# Altium project PCB_Project.PrjPcb
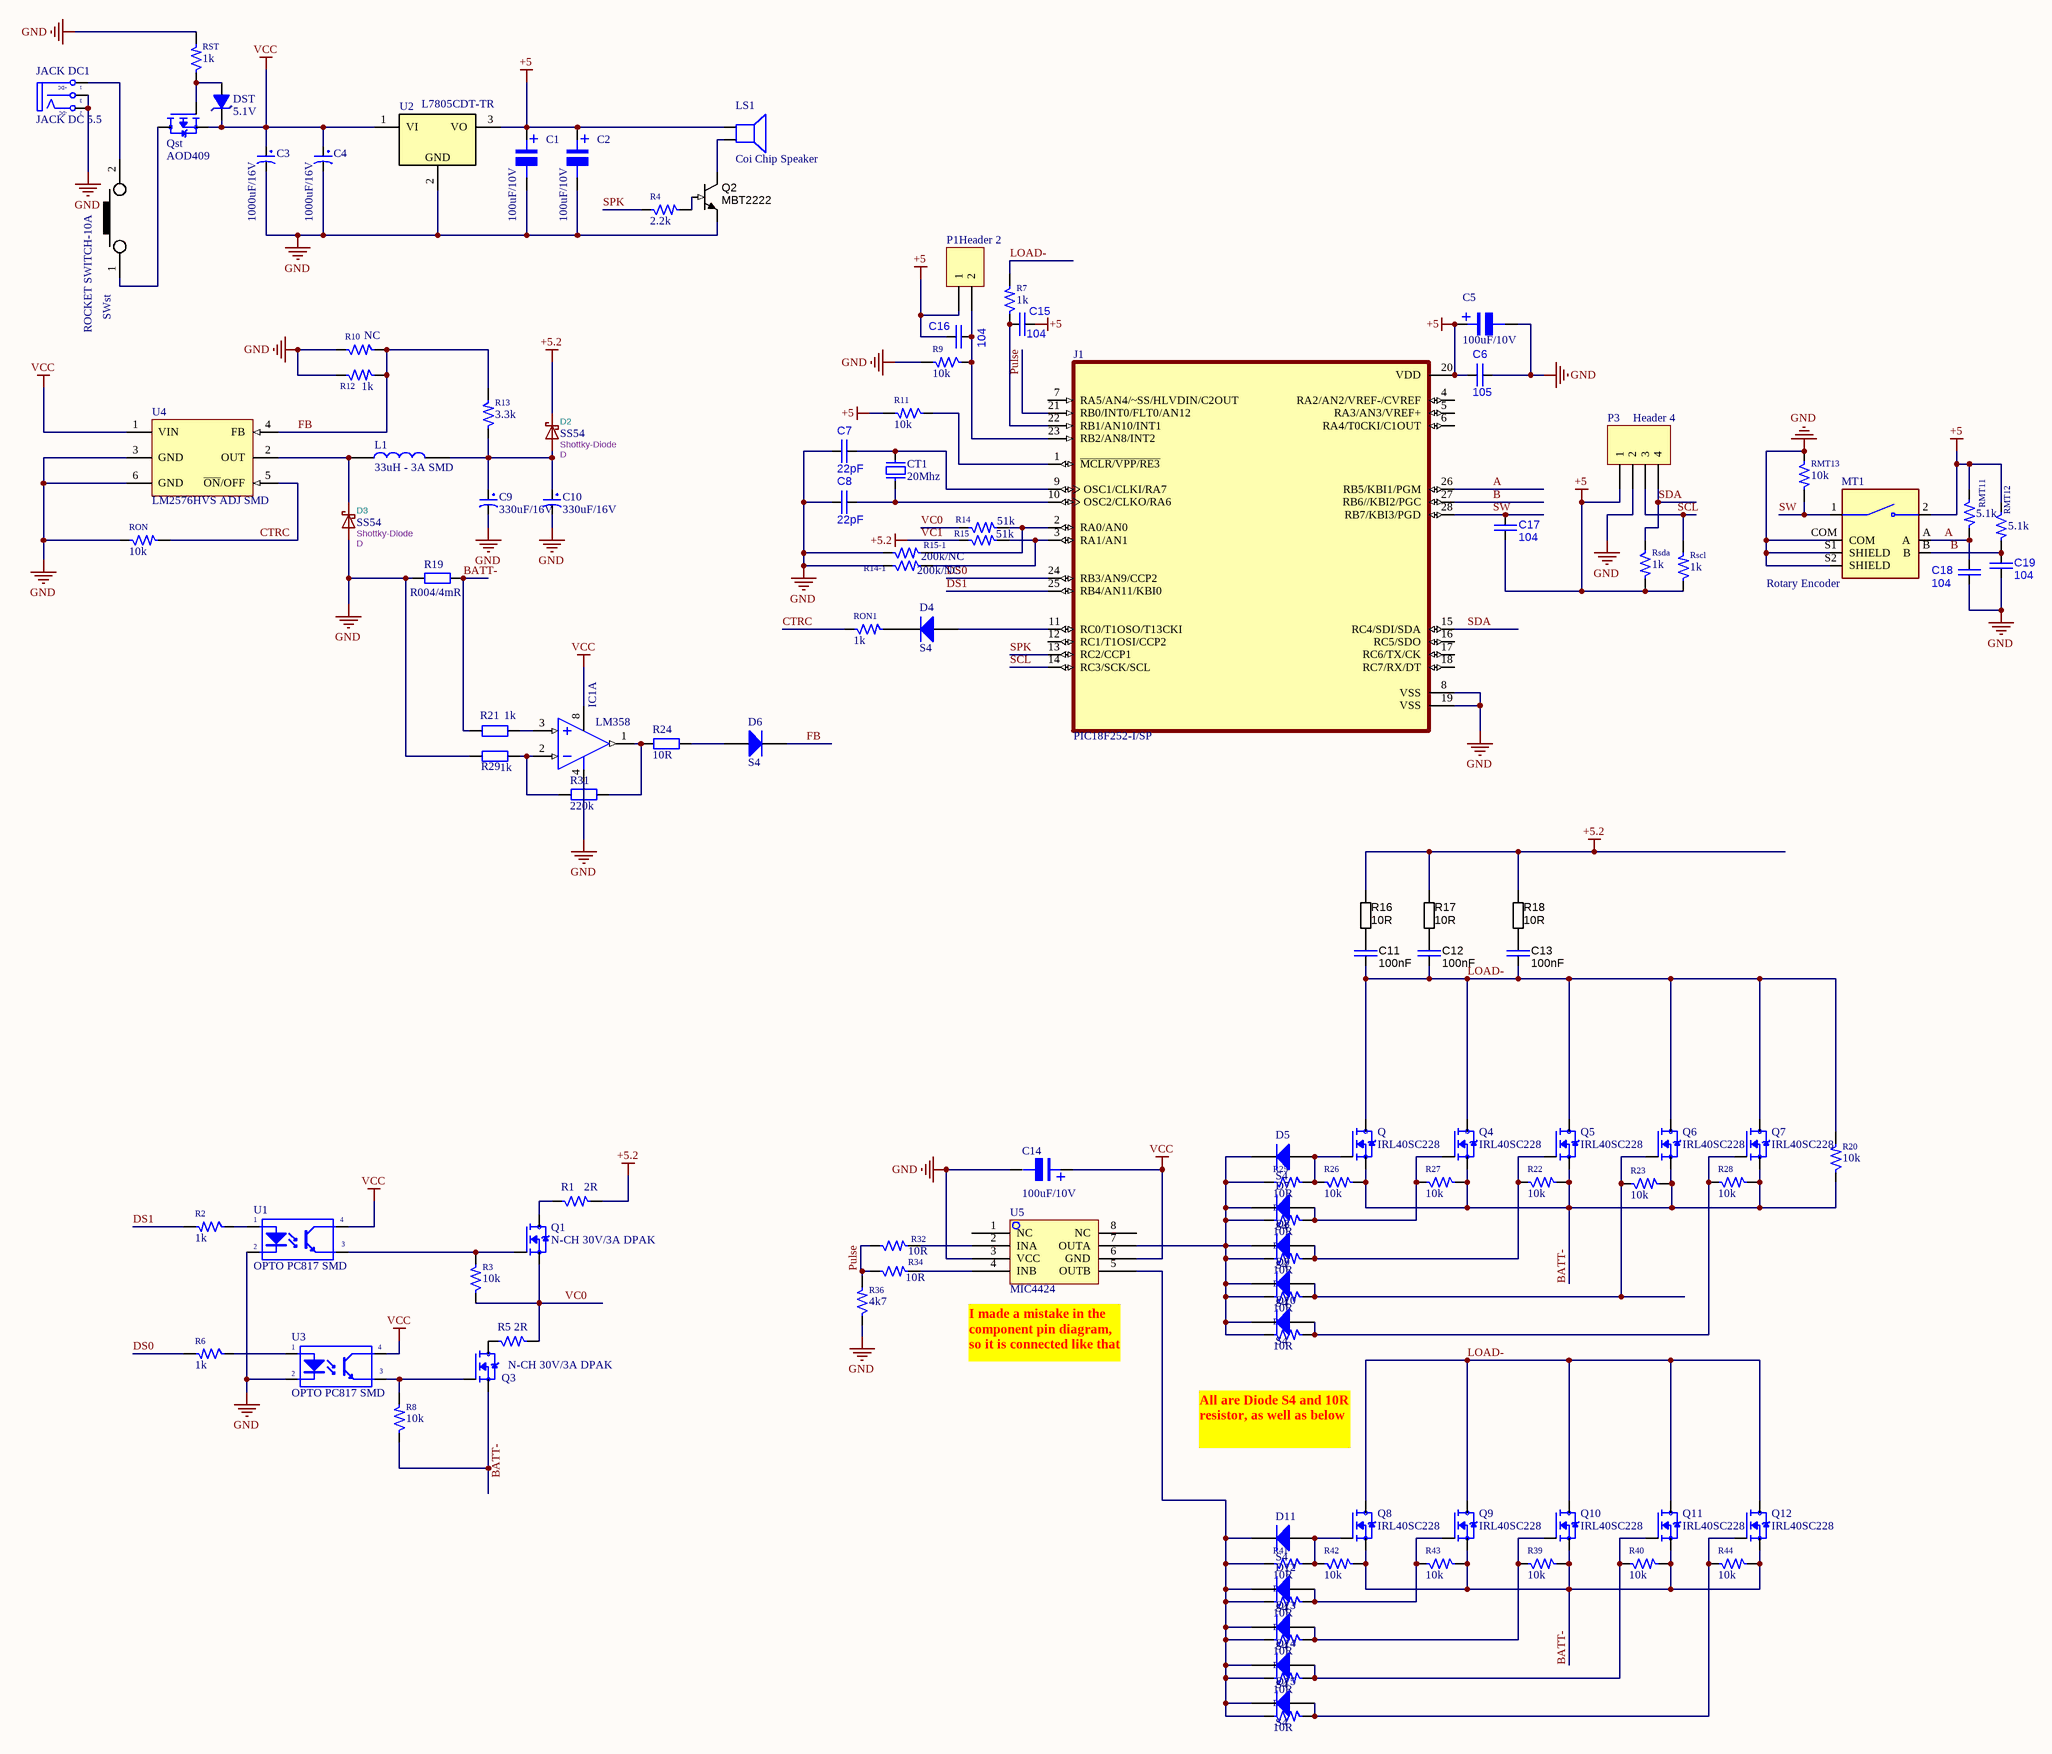
[diagram p0: Spot Welder OLED.SchDoc]
1 sheet, 120 parts. Net scope: global (net labels, ports and power ports of the same name join across sheets).
Board file: Spot Welder Layout.PcbDoc

## Sheet Spot Welder OLED.SchDoc
size C; SheetNumber: 1; SheetTotal: 1

### Parts
C1  100uF/10V  [tu nhom 6.3 (d)]
C2  100uF/10V  [tu nhom 6.3 (d)]
C3  1000uF/16V  [tu hoa 10mm]
C4  1000uF/16V  [tu hoa 10mm]
C5  100uF/10V  [tu nhom 6.3 (d)]
C6  value 105  [CAPC2012X135N]  (hidden comment: 0805)
C7  value 22pF  [CAPC2012X135N]  (hidden comment: 0805)
C8  value 22pF  [CAPC2012X135N]  (hidden comment: 0805)
C9  330uF/16V  [tu hoa 10mm]
C10  330uF/16V  [tu hoa 10mm]
C11  value 100nF  [CAPC3216X180N]  (hidden comment: 1206)
C12  value 100nF  [CAPC3216X180N]  (hidden comment: 1206)
C13  value 100nF  [CAPC3216X180N]  (hidden comment: 1206)
C14  100uF/10V  [tu nhom 6.3 (d)]
C15  value 104  [CAPC2012X135N]  (hidden comment: 0805)
C16  value 104  [CAPC2012X135N]  (hidden comment: 0805)
C17  value 104  [CAPC2012X135N]  (hidden comment: 0805)
C18  value 104  [CAPC2012X135N]  (hidden comment: 0805)
C19  value 104  [CAPC2012X135N]  (hidden comment: 0805)
CT1  20Mhz  [CRYSTAL]
D2  SS54  value Shottky-Diode  Reference: D  [DO-214AB_SMC]
D3  SS54  value Shottky-Diode  Reference: D  [DO-214AB_SMC]
D4  S4  [DIODE SOD-123]
D5  S4  [DIODE SOD-123]
D6  S4  [DIODE SOD-123]
D7  S4  [DIODE SOD-123]
D8  S4  [DIODE SOD-123]
D9  S4  [DIODE SOD-123]
D10  S4  [DIODE SOD-123]
D11  S4  [DIODE SOD-123]
D12  S4  [DIODE SOD-123]
D13  S4  [DIODE SOD-123]
D14  S4  [DIODE SOD-123]
D15  S4  [DIODE SOD-123]
DST  5.1V  [DIODE ZENNER SMD SOD80]
IC1  LM358  [SOp 8]  (part A of 2)
J1  PIC18F252-I/SP  [DIP787W46P254L3467H508Q28]
JACK_DC1  JACK DC 5.5  [JACK DC 5.5]
L1  33uH - 3A SMD  [Cuon Cam 12x12x10]
LS1  Coi Chip Speaker  [Coi Chip Speacker]
MT1  Rotary Encoder  [XDCR_PEC11R-4215F-S0024]
P1  Header 2  [HDR1X2]
P3  Header 4  [HDR1X4]
Q  IRL40SC228  [DPAK127P1524X483-8N]
Q1  N-CH 30V/3A DPAK  [TO229P990X239-4N]
Q2  MBT2222  [SOT23-3]
Q3  N-CH 30V/3A DPAK  [TO229P990X239-4N]
Q4  IRL40SC228  [DPAK127P1524X483-8N]
Q5  IRL40SC228  [DPAK127P1524X483-8N]
Q6  IRL40SC228  [DPAK127P1524X483-8N]
Q7  IRL40SC228  [DPAK127P1524X483-8N]
Q8  IRL40SC228  [DPAK127P1524X483-8N]
Q9  IRL40SC228  [DPAK127P1524X483-8N]
Q10  IRL40SC228  [DPAK127P1524X483-8N]
Q11  IRL40SC228  [DPAK127P1524X483-8N]
Q12  IRL40SC228  [DPAK127P1524X483-8N]
Qst  AOD409  [TO252]
R1  2R  [R2W]
R2  1k  [SM-RES-0805]
R3  10k  [SM-RES-0805]
R4  2.2k  [SM-RES-0805]
R5  2R  [R2W]
R6  1k  [SM-RES-0805]
R7  1k  [SM-RES-0805]
R8  10k  [SM-RES-0805]
R9  10k  [SM-RES-0805]
R10  NC  [SM-RES-0805]
R11  10k  [SM-RES-0805]
R12  1k  [SM-RES-0805]
R13  3.3k  [SM-RES-0805]
R14  51k  [SM-RES-0805]
R14-1  200k/NC  [SM-RES-0805]
R15  51k  [SM-RES-0805]
R15-1  200k/NC  [SM-RES-0805]
R16  value 10R  [RESC3216N_ZERO]  (hidden comment: Thick Film)
R17  value 10R  [RESC3216N_ZERO]  (hidden comment: Thick Film)
R18  value 10R  [RESC3216N_ZERO]  (hidden comment: Thick Film)
R19  R004/4mR  [tro smd 2512]
R20  10k  [SM-RES-0805]
R21  1k  [tro smd 0805]
R22  10k  [SM-RES-0805]
R23  10k  [SM-RES-0805]
R24  10R  [tro smd 0805]
R25  10R  [SM-RES-0805]
R26  10k  [SM-RES-0805]
R27  10k  [SM-RES-0805]
R28  10k  [SM-RES-0805]
R29  1k  [tro smd 0805]
R30  10R  [SM-RES-0805]
R31  220k  [tro smd 0805]
R32  10R  [SM-RES-0805]
R33  10R  [SM-RES-0805]
R34  10R  [SM-RES-0805]
R35  10R  [SM-RES-0805]
R36  4k7  [SM-RES-0805]
R38  10R  [SM-RES-0805]
R39  10k  [SM-RES-0805]
R40  10k  [SM-RES-0805]
R41  10R  [SM-RES-0805]
R42  10k  [SM-RES-0805]
R43  10k  [SM-RES-0805]
R44  10k  [SM-RES-0805]
R45  10R  [SM-RES-0805]
R46  10R  [SM-RES-0805]
R47  10R  [SM-RES-0805]
R48  10R  [SM-RES-0805]
RMT11  5.1k  [SM-RES-0805]
RMT12  5.1k  [SM-RES-0805]
RMT13  10k  [SM-RES-0805]
RON  10k  [SM-RES-0805]
RON1  1k  [SM-RES-0805]
Rscl  1k  [SM-RES-0805]
Rsda  1k  [SM-RES-0805]
RST  1k  [SM-RES-0805]
SWst  ROCKET SWITCH-10A  [SW_2ARS_TH]
U1  OPTO PC817 SMD  [SOP4]
U2  L7805CDT-TR  [DPAK_118_446_112X59_SMD]
U3  OPTO PC817 SMD  [SOP4]
U4  LM2576HVS ADJ SMD  [TO263-5]
U5  MIC4424  [SOp 8]

### Nets
+5: C1.1 C2.1 C5.1 C6.1 C15.2 C16.2 C17.1 J1.20(VDD) LS1.1 MT1.2 P1.1 P3.1 R11.2 RMT11.1 RMT12.1 Rscl.1 Rsda.2 U2.3(VO)
GND: C1.2 C2.2 C3.2 C4.2 C5.2 C6.2 C7.1 C8.1 C9.2 C10.2 C14.2 C18.1 C19.1 D3.A IC1.4(-V) J1.8(VSS) J1.19(VSS) JACK_DC1.2(TN) JACK_DC1.3(S) MT1.COM MT1.S1(SHIELD) MT1.S2(SHIELD) P3.2 Q2.2(E) R9.2 R10.1 R12.1 R14-1.1 R15-1.1 R19.1 R29.1 R36.1 RMT13.1 RON.1 RST.2 U1.2(K) U2.2 U3.2(K) U4.3(GND) U4.6(GND) U5.3(VCC)
VC1: D2.K R1.2 R15.1 R16.1 R17.1 R18.1  [also labelled +5.2]
VCC: C3.1 C4.1 C14.1 DST.2(K) IC1.8(+V) Qst.2(S) U1.4(C) U2.1(VI) U3.4(C) U4.1(VIN) U5.6(GND)
A: C18.2 J1.26(RB5/KBI1/PGM) MT1.A RMT11.2
B: C19.2 J1.27(RB6//KBI2/PGC) MT1.B RMT12.2
BATT-: Q.2-8(S) Q3.3(S) Q4.2-8(S) Q5.2-8(S) Q6.2-8(S) Q7.2-8(S) Q8.2-8(S) Q9.2-8(S) Q10.2-8(S) Q11.2-8(S) Q12.2-8(S) R8.1 R19.2 R20.1 R21.1 R22.2 R23.2 R26.2 R27.2 R28.2 R39.2 R40.2 R42.2 R43.2 R44.2
CTRC: RON.2 RON1.1 U4.5(~{ON}/OFF)
DS0: J1.24(RB3/AN9/CCP2) R6.2
DS1: J1.25(RB4/AN11/KBI0) R2.2
FB: D6.2(K) R10.2 R12.2 R13.2 U4.4(FB)
LOAD-: C11.1 C12.1 C13.1 Q.9(D) Q4.9(D) Q5.9(D) Q6.9(D) Q7.9(D) Q8.9(D) Q9.9(D) Q10.9(D) Q11.9(D) Q12.9(D) R7.2 R20.2
Pulse: J1.21(RB0/INT0/FLT0/AN12) R32.1 R34.1 R36.2
SCL: J1.14(RC3/SCK/SCL) P3.3 Rscl.2
SDA: J1.15(RC4/SDI/SDA) P3.4 Rsda.1
SPK: J1.13(RC2/CCP1) R4.1
SW: C17.2 J1.28(RB7/KBI3/PGD) MT1.1 RMT13.2
VC0: Q1.3(S) R3.1 R5.2 R14.1
NetC7_2: C7.2 CT1.2 J1.9(OSC1/CLKI/RA7)
NetC8_2: C8.2 CT1.1 J1.10(OSC2/CLKO/RA6)
NetC9_1: C9.1 C10.1 D2.A L1.2 R13.1
NetC11_2: C11.2 R16.2
NetC12_2: C12.2 R17.2
NetC13_2: C13.2 R18.2
NetC15_1: C15.1 J1.22(RB1/AN10/INT1) R7.1
NetC16_1: C16.1 J1.23(RB2/AN8/INT2) P1.2 R9.1
NetD3_K: D3.K L1.1 U4.2(OUT)
NetD4_1: D4.1(A) J1.11(RC0/T1OSO/T13CKI)
NetD4_2: D4.2(K) RON1.2
NetD5_1: D5.1(A) Q.1(G) R25.2 R26.1
NetD5_2: D5.2(K) D7.2(K) D8.2(K) D9.2(K) D10.2(K) R25.1 R30.1 R33.1 R35.1 R38.1 U5.7(OUTA)
NetD6_1: D6.1(A) R24.2
NetD7_1: D7.1(A) Q4.1(G) R27.1 R30.2
NetD8_1: D8.1(A) Q5.1(G) R22.1 R33.2
NetD9_1: D9.1(A) Q6.1(G) R23.1 R35.2
NetD10_1: D10.1(A) Q7.1(G) R28.1 R38.2
NetD11_1: D11.1(A) Q8.1(G) R41.2 R42.1
NetD11_2: D11.2(K) D12.2(K) D13.2(K) D14.2(K) D15.2(K) R41.1 R45.1 R46.1 R47.1 R48.1 U5.5(OUTB)
NetD12_1: D12.1(A) Q9.1(G) R43.1 R45.2
NetD13_1: D13.1(A) Q10.1(G) R39.1 R46.2
NetD14_1: D14.1(A) Q11.1(G) R40.1 R47.2
NetD15_1: D15.1(A) Q12.1(G) R44.1 R48.2
NetDST_1: DST.1(A) Qst.1(G) RST.1
NetIC1_1: IC1.1(OUT) R24.1 R31.2
NetIC1_2: IC1.2(IN-) R29.2 R31.1
NetIC1_3: IC1.3(IN+) R21.2
NetJ1_1: J1.1(~{MCLR/VPP/RE3}) R11.1
NetJ1_2: J1.2(RA0/AN0) R14.2 R14-1.2
NetJ1_3: J1.3(RA1/AN1) R15.2 R15-1.2
NetJACK_DC1_1: JACK_DC1.1(T) SWst.2
NetLS1_2: LS1.2 Q2.3(C)
NetQ1_1: Q1.1(G) R3.2 U1.3(E)
NetQ1_4: Q1.4(D) R1.1
NetQ2_1: Q2.1(B) R4.2
NetQ3_1: Q3.1(G) R8.2 U3.3(E)
NetQ3_4: Q3.4(D) R5.1
NetQst_3: Qst.3(D) SWst.1
NetR2_1: R2.1 U1.1(A)
NetR6_1: R6.1 U3.1(A)
NetR32_2: R32.2 U5.2(INA)
NetR34_2: R34.2 U5.4(INB)

Not connected (* = marked no-connect by the designer): J1 4(RA2/AN2/VREF-/CVREF) 5(RA3/AN3/VREF+) 6(RA4/T0CKI/C1OUT) 7(RA5/AN4/~SS/HLVDIN/C2OUT) 12(RC1/T1OSI/CCP2) 16(RC5/SDO) 17(RC6/TX/CK) 18(RC7/RX/DT); U5 1(NC) 8(NC)

### Notes on the sheet
- (near U5) I made a mistake in the component pin diagram, so it is connected like that
- All are Diode S4 and 10R resistor, as well as below
- (in symbol JACK DC 5.5) +DC; -DC
- (in symbol REG_35V_5V-1.5A-7.5W-DPAK) GND
- (in symbol Tu Nhom 100uF 16V) +

### Library data of the parts
C1 C2 C5 C14 = Tu Nhom 100uF 16V: Dán; Don_Vi: Con; So_Chan: 2; Ten_Linh_Kien: Tụ Nhôm 100uF 16V 6.3x5.4MM; Ma_Hang: MH002219; Chung_Loai: Dán; Kieu_Chan: *
C3 C4 C9 C10 = Tu Hoa 2200uF 16V 10x20: Cắm; Don_Vi: Con; So_Chan: 2; Ten_Linh_Kien: Tụ Hóa 2200uF 16V 10x20MM; Ma_Hang: MH002316; Chung_Loai: Cắm; Kieu_Chan: *
C6-C8 C15-C19 = CAP C_0805: Capacitor SMD Cer 1.8nF 10% 50V X7R 0805; Manufacturer 1: AVX Corporation; Manufacturer Part Number 1: 08055C182KAT2A; Ratings: 50V; X7R; SCDType: source*; Tolerance: ±10%; Operating Temperature: -55°C ~ 125°C; Package / Case: 0805 (2012 metric); Supplier 1: Digi-Key; Supplier Part Number 1: 478-1374-1-ND
C11-C13 = CAP C_1206: Capacitor SMD Cer 220nF 10% 16V X7R 1206; Manufacturer 1: Murata; Manufacturer Part Number 1: GRM319R71C224KA01D; Ratings: 16V; X7R; SCDType: spec; Tolerance: ±10%; Package / Case: 1206 (3216 metric); Supplier 1: Mouser; Supplier Part Number 1: 81-GRM426X224K016D
CT1 = CRYSTAL: Crystal For all Crystal 2pin.; Value: 4Mhz
D2 D3 = Schottky-Diode: ki_description: Schottky Diode; Datasheet: https://diotec.com/de/produktliste/SBD.html; ki_keywords: Schottky
D4-D15 = Diode S4: Dán; Ten_Linh_Kien: Diode S4 SOD123 ( 1N5819 SOD123); Ma_Hang: MH005519; Don_Vi: Con; Ghi_Chu: *; Chung_Loai: Dán; Kieu_Chan: *
DST = Diode Zener 5.1V: Dán; Ma_Hang: MH002881; Ten_Linh_Kien: Diode Zener 1/2W 5.1V SMD1206 ZMM5.1; Don_Vi: Con; Kieu_Chan: *; Ghi_Chu: *; Chung_Loai: Dán
IC1 = LM358: Low-Power Dual Operational Amplifier; Value: LM358
J1 = PIC18F252-I/SP: PIC PICÂ® 18F Microcontroller IC 8-Bit 40MHz 32KB (16K x 16) FLASH 28-SPDIP; MF: Microchip Technology; MP: PIC18F252-I/SP; Package: SPDIP-28 Microchip; Availability: In Stock; Price: None; Purchase-URL: https://pricing.snapeda.com/search/part/PIC18F252-I/SP/?ref=eda; Check_prices: https://www.snapeda.com/parts/PIC18F252-I/SP/Microchip/view-part/?ref=eda; SnapEDA_Link: https://www.snapeda.com/parts/PIC18F252-I/SP/Microchip/view-part/?ref=snap; Value: *
JACK_DC1 = JACK DC 5.5: Value: Jac DC
L1 = CUON CAM 100uH SMD: Dán; Don_Vi: Con; Ma_Hang: MH003999; Ten_Linh_Kien: Cuộn Cảm 100uH 7x7x4MM CD74; Ma_Hang: *; Kieu_Chan: *; Chung_Loai: Dán
LS1 = Coi Chip Speaker: Còi chip
MT1 = PEC11R-4215F-S0024: Incremental Encoder, 12 Mm, Contact Rating 10 Ma - 5 Vdc; Price: None; Availability: Unavailable; MP: PEC11R-4215F-S0024; Value: *; Package: None
P1 = Header 2: Header, 2-Pin; LatestRevisionDate: 17-Jul-2002; LatestRevisionNote: Re-released for DXP Platform.; Publisher: Altium Limited
P3 = Header 4: Header, 4-Pin; LatestRevisionDate: 17-Jul-2002; LatestRevisionNote: Re-released for DXP Platform.; Publisher: Altium Limited
Q Q4-Q12 = IPT020N10N5: OptiMOSâ„¢ 5 100V power MOSFET in TO-Leadless (TOLL) package with 60% space reduction for telecom and low voltage drives applications; MF: Infineon Technologies; Price: None; Availability: Unavailable; MP: IPT020N10N5; Package: HSOF-8 Infineon Technologies; SnapEDA_Link: https://www.snapeda.com/parts/IPT020N10N5/Infineon%20Technologies/view-part/4624899/?ref=snap; Value: *
Q1 Q3 = IRFR3710ZTRPBF: N-Channel 100 V 42A (Tc) 140W (Tc) Surface Mount D-Pak; MF: Infineon; Availability: In Stock; Value: *; Check_prices: https://www.snapeda.com/parts/IRFR3710ZTRPBF/Infineon/view-part/?ref=eda; Package: TO-252 International Rectifier; Price: None; MP: IRFR3710ZTRPBF; SnapEDA_Link: https://www.snapeda.com/parts/IRFR3710ZTRPBF/Infineon/view-part/?ref=snap; Purchase-URL: https://pricing.snapeda.com/search/part/IRFR3710ZTRPBF/?ref=eda
Q2 = NPN_MMBT2222A: Transistor SMD NPN 40V 600mA 250mW SOT23-3; Manufacturer 1: Fairchild Semiconductor; Ratings: 40V; 600mA; 250mW; Material: Si; SCDType: source; Package / Case: SOT-23; Mounting Type: Surface Mount; Supplier 1: Digi-Key; Supplier Part Number 1: MMBT2222AFSTR-ND; Manufacturer 2: NXP Semiconductors; Manufacturer Part Number 2: MMBT2222A; Manufacturer Part Number 1: MMBT2222A; Supplier 2: Digi-Key; Supplier Part Number 2: 568-4509-2-ND; Value: MBT2222
Qst = AOD409: P-Channel 60V 26A (Tc) 2.5W (Ta), 60W (Tc) Surface Mount TO-252, (D-Pak); MF: Alpha &; Value: *; Availability: Unavailable; Price: None; SnapEDA_Link: https://www.snapeda.com/parts/AOD409/Alpha%20&%20Omega%20Semiconductor%20Inc./view-part/554087/?ref=snap; MP: AOD409; DigiKey-Purchase-URL: https://snapeda.com/shop?store=DigiKey&id=554087; Package: TO-252 Alpha &amp; Omega Semiconductor
R1 R5 = Res
R2-R4 R6-R14 R14-1 R15 R15-1 R20 R22 R23 R25-R28 R30 R32-R36 R38-R48 RMT11-RMT13 RON RON1 Rscl Rsda RST = Res SMD: Res
R16-R18 = RES_1206: Resistor SMD chip 0.0 Ohm 0.25W 1206; Manufacturer 1: Vishay/Dale; Manufacturer Part Number 1: CRCW12060000Z0EA; Tolerance: ±5%; Ratings: 1/4W; SCDType: spec*\?; Package / Case: 1206 (3216 metric); Supplier 1: Digi-Key; Supplier Part Number 1: 541-0.0ECT-ND
R19 = Tro 2512 5% 0.1R: Dán; Don_Vi: Con; So_Chan: 2; Ten_Linh_Kien: Trở 2512 5% 0.1R 1W; Ma_Hang: MH004711; Chung_Loai: Dán; Kieu_Chan: *
R21 R24 R29 = Tro 0805 1% 1k: Dán; Don_Vi: Con; So_Chan: 2; Ten_Linh_Kien: Trở 0805 1% 1k; Ma_Hang: MH005468; Chung_Loai: Dán; Kieu_Chan: *
R31 = Tro 0805 1% 33k: Dán; Don_Vi: Con; So_Chan: 2; Ten_Linh_Kien: Trở 0805 1% 33k; Ma_Hang: MH005478; Chung_Loai: Dán; Kieu_Chan: *
SWst = SW1_10A-SRB23A2BBBNN-TH: Rocker Switch SPDT 10A (AC) 125V Panel Mount, Snap-In; Manufacturer: ITT C&K; Alternate Part Number-1: NA; Manufacturer Part Number: SRB23A2BBBNN; Case/Package: TH; Supplier-1: SP ROAD; Supplier Part Number-1: SRB23A2BBBNN
U1 U3 = OPTO PC817 SMD: Single Opto; Value: PC817
U2 = REG_35V_5V-1.5A-7.5W-DPAK: Linear Voltage Regulator IC 1 Output 1.5A DPAK; Manufacturer: Diodes; Alternate Part Number-1: CJ7805 3%; Manufacturer Part Number: L7805CDT-TR; Case/Package: DPAK; Supplier-1: SP ROAD; Supplier Part Number-1: L7805CDT-TR
U4 = LM2576HVS ADJ SMD: Dán; Ten_Linh_Kien: LM2576HVS-ADJ BUCK ADJ 3A TO263-5; Don_Vi: Con; Ma_Hang: MH002361; Ghi_Chu: *; Kieu_Chan: *; Chung_Loai: Dán